# EAGLE design STM (EAGLE 6.3)
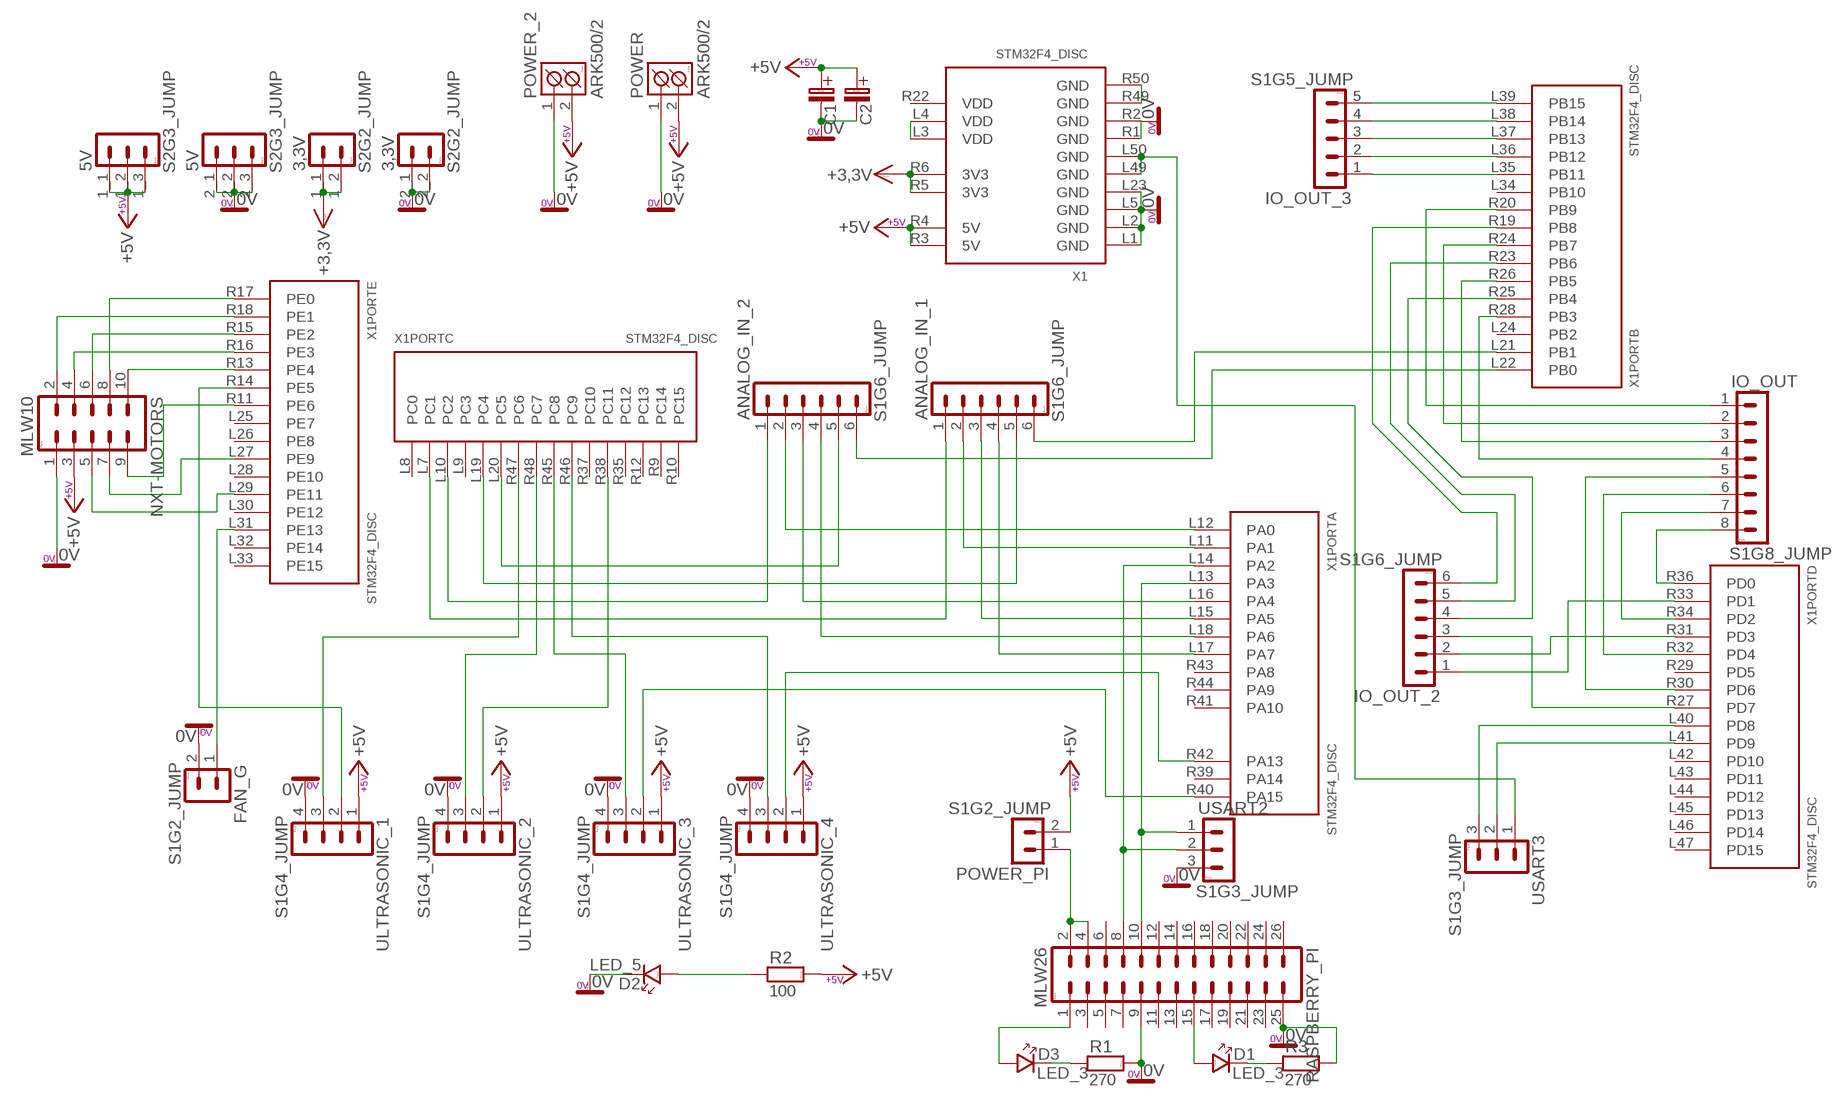
[diagram p0: schematic, sheet 1]

## Parts
3,3V  S2G2_JUMP  [S2G2_JUM]
5V  S2G3_JUMP  [S2G3_JUM]
ANALOG_IN_1  S1G6_JUMP  [S1G6_JUM]
ANALOG_IN_2  S1G6_JUMP  [S1G6_JUM]
C1  #_RADIAL_POUZDRA5  [C_EL_5]
C2  #_RADIAL_POUZDRA5  [C_EL_5]
D1  LED_3  [LED_3]
D2  LED_5  [LED_5]
D3  LED_3  [LED_3]
FAN_G  S1G2_JUMP  [S1G2_JUM]
IO_OUT  S1G8_JUMP  [S1G8_JUM]
IO_OUT_2  S1G6_JUMP  [S1G6_JUM]
IO_OUT_3  S1G5_JUMP  [S1G5_JUM]
NXT-MOTORS  MLW10  [MLW10G]
POWER  ARK500/2  [ARK500/2]
POWER_2  ARK500/2  [ARK500/2]
POWER_PI  S1G2_JUMP  [S1G2_JUM]
R1  270  4K7  [R_7,5]
R2  100  100R  [R_7,5]
R3  270  4K7  [R_7,5]
RASPBERRY_PI  MLW26  [MLW26G]
ULTRASONIC_1  S1G4_JUMP  [S1G4_JUM]
ULTRASONIC_2  S1G4_JUMP  [S1G4_JUM]
ULTRASONIC_3  S1G4_JUMP  [S1G4_JUM]
ULTRASONIC_4  S1G4_JUMP  [S1G4_JUM]
USART2  S1G3_JUMP  [S1G3_JUM]
USART3  S1G3_JUMP  [S1G3_JUM]
X1  STM32F4_DISC  [STM32F4_DISC]

## Nets
0V: 3,3V.2_1 3,3V.2_2 5V.2_1 5V.2_2 5V.2_3 C1.C-(C_EL-) C2.C-(C_EL-) D2.K FAN_G.2 NXT-MOTORS.1 POWER.1(K1) POWER_2.1(K1) R1.2 R3.2 RASPBERRY_PI.9 RASPBERRY_PI.25 ULTRASONIC_1.4 ULTRASONIC_2.4 ULTRASONIC_3.4 ULTRASONIC_4.4 USART2.3 X1.L1(GND) X1.L2(GND) X1.L5(GND) X1.L23(GND) X1.R1(GND) X1.R2(GND)
+5V: 5V.1_1 5V.1_2 5V.1_3 C1.C+(C_EL+) C2.C+(C_EL+) NXT-MOTORS.3 POWER.2(K2) POWER_2.2(K2) POWER_PI.2 R2.2 ULTRASONIC_1.1 ULTRASONIC_2.1 ULTRASONIC_3.1 ULTRASONIC_4.1 X1.R3(5V) X1.R4(5V)
N$1: ANALOG_IN_1.6 X1.L21(PB1)
N$2: NXT-MOTORS.8 X1.R17(PE0)
N$3: RASPBERRY_PI.8 USART2.2 X1.L14(PA2)
N$4: RASPBERRY_PI.10 USART2.1 X1.L13(PA3)
N$5: USART3.2 X1.L41(PD9)
N$6: USART3.3 X1.L40(PD8)
N$7: NXT-MOTORS.2 X1.R18(PE1)
N$8: NXT-MOTORS.6 X1.R15(PE2)
N$9: NXT-MOTORS.10 X1.R13(PE4)
N$10: NXT-MOTORS.4 X1.R16(PE3)
N$11: NXT-MOTORS.5 X1.L29(PE11)
N$12: ULTRASONIC_1.2 X1.R14(PE5)
N$13: NXT-MOTORS.7 X1.L27(PE9)
N$14: NXT-MOTORS.9 X1.R11(PE6)
N$15: ULTRASONIC_1.3 X1.R47(PC6)
N$16: ULTRASONIC_4.3 X1.R46(PC9)
N$17: ULTRASONIC_2.3 X1.R48(PC7)
N$18: ULTRASONIC_3.3 X1.R45(PC8)
N$19: ANALOG_IN_2.3 X1.L16(PA4)
N$20: ANALOG_IN_1.2 X1.L11(PA1)
N$21: ANALOG_IN_2.2 X1.L12(PA0)
N$22: ANALOG_IN_1.3 X1.L15(PA5)
N$23: ANALOG_IN_1.4 X1.L17(PA7)
N$24: ANALOG_IN_2.4 X1.L18(PA6)
N$25: ANALOG_IN_2.6 X1.L22(PB0)
N$26: X1.L3(VDD) X1.L4(VDD)
N$27: FAN_G.1 X1.L31(PE13)
N$28: D1.K R3.1
N$29: D1.A RASPBERRY_PI.15
N$30: D2.A R2.1
N$31: IO_OUT.4 X1.R28(PB3)
N$32: IO_OUT.3 X1.R26(PB5)
N$33: IO_OUT.2 X1.R24(PB7)
N$34: IO_OUT_2.3 X1.R27(PD7)
N$35: IO_OUT.5 X1.R30(PD6)
N$36: IO_OUT.6 X1.R32(PD4)
N$37: IO_OUT_2.2 X1.R31(PD3)
N$38: IO_OUT.7 X1.R34(PD2)
N$39: IO_OUT_2.1 X1.R33(PD1)
N$40: IO_OUT.8 X1.R36(PD0)
N$41: IO_OUT.1 X1.R20(PB9)
N$42: IO_OUT_2.5 X1.R23(PB6)
N$43: IO_OUT_3.2 X1.L36(PB12)
N$44: D3.K R1.1
N$45: IO_OUT_3.4 X1.L38(PB14)
N$46: IO_OUT_2.6 X1.R19(PB8)
N$47: IO_OUT_2.4 X1.R25(PB4)
N$48: IO_OUT_3.1 X1.L35(PB11)
N$49: D3.A RASPBERRY_PI.1
N$50: IO_OUT_3.3 X1.L37(PB13)
N$51: POWER_PI.1 RASPBERRY_PI.2 RASPBERRY_PI.4
N$52: IO_OUT_3.5 X1.L39(PB15)
N$53: USART3.1 X1.L49(GND) X1.L50(GND)
N$54: ANALOG_IN_2.5 X1.L20(PC5)
N$55: ANALOG_IN_1.5 X1.L19(PC4)
N$56: ANALOG_IN_2.1 X1.L10(PC2)
N$57: ANALOG_IN_1.1 X1.L7(PC1)
N$58: ULTRASONIC_2.2 X1.R38(PC11)
N$59: ULTRASONIC_3.2 X1.R40(PA15)
N$60: ULTRASONIC_4.2 X1.R42(PA13)
N$61: X1.R49(GND) X1.R50(GND)
VCC: 3,3V.1_1 3,3V.1_2 X1.R5(3V3) X1.R6(3V3) ; supply symbol labelled +3,3V
Unconnected: RASPBERRY_PI.3 RASPBERRY_PI.5 RASPBERRY_PI.6 RASPBERRY_PI.7 RASPBERRY_PI.11 RASPBERRY_PI.12 RASPBERRY_PI.13 RASPBERRY_PI.14 RASPBERRY_PI.16 RASPBERRY_PI.17 RASPBERRY_PI.18 RASPBERRY_PI.19 RASPBERRY_PI.20 RASPBERRY_PI.21 RASPBERRY_PI.22 RASPBERRY_PI.23 RASPBERRY_PI.24 RASPBERRY_PI.26 X1.L6(!RST) X1.L8(PC0) X1.L9(PC3) X1.L24(PB2) X1.L25(PE7) X1.L26(PE8) X1.L28(PE10) X1.L30(PE12) X1.L32(PE14) X1.L33(PE15) X1.L34(PB10) X1.L42(PD10) X1.L43(PD11) X1.L44(PD12) X1.L45(PD13) X1.L46(PD14) X1.L47(PD15) X1.L48(NC) X1.R7(PH0) X1.R8(PH1) X1.R9(PC14) X1.R10(PC15) X1.R12(PC13) X1.R21(BOOT0) X1.R29(PD5) X1.R35(PC12) X1.R37(PC10) X1.R39(PA14) X1.R41(PA10) X1.R43(PA8) X1.R44(PA9) X1.T1(JP2A) X1.T2(JP2B) X1.T3(JP3A) X1.T4(JP3B)

## Power pins joined to a net without a drawn wire
VDD: X1.R22(VDD)

## Library data of the parts
3,3V = #PaJa_konektory:S2G2_JUMP: Radove konektory - koliky - dvojite - 2x2
5V = #PaJa_konektory:S2G3_JUMP: Radove konektory - koliky - dvojite - 2x3
ANALOG_IN_1 ANALOG_IN_2 IO_OUT_2 = #PaJa_konektory:S1G6_JUMP: Radove konektory - koliky - 6x
C1 C2 = #PaJa_C-el_2:#_RADIAL_POUZDRA
D1-D3 = #PaJa_30:LED: LED - jednobarevna
FAN_G POWER_PI = #PaJa_konektory:S1G2_JUMP: Radove konektory - koliky - 2x
IO_OUT = #PaJa_konektory:S1G8_JUMP: Radove konektory - koliky - 8x
IO_OUT_3 = #PaJa_konektory:S1G5_JUMP: Radove konektory - koliky - 5x
NXT-MOTORS = #PaJa_konektory:MLW10: Konektory MLW - vidlice - 10x
POWER POWER_2 = #PaJa_konektory:ARK500/2: Svorkovnice - roztec 5mm - dvojita
R1 R3 = #PaJa_R:4K7
R2 = #PaJa_R:100R
RASPBERRY_PI = #PaJa_konektory:MLW26: Konektory MLW - vidlice - 26x
ULTRASONIC_1-ULTRASONIC_4 = #PaJa_konektory:S1G4_JUMP: Radove konektory - koliky - 4x
USART2 USART3 = #PaJa_konektory:S1G3_JUMP: Radove konektory - koliky - 3x
X1 = stm32f4_disc:STM32F4_DISC: STM32F4 Discovery Board

## Board
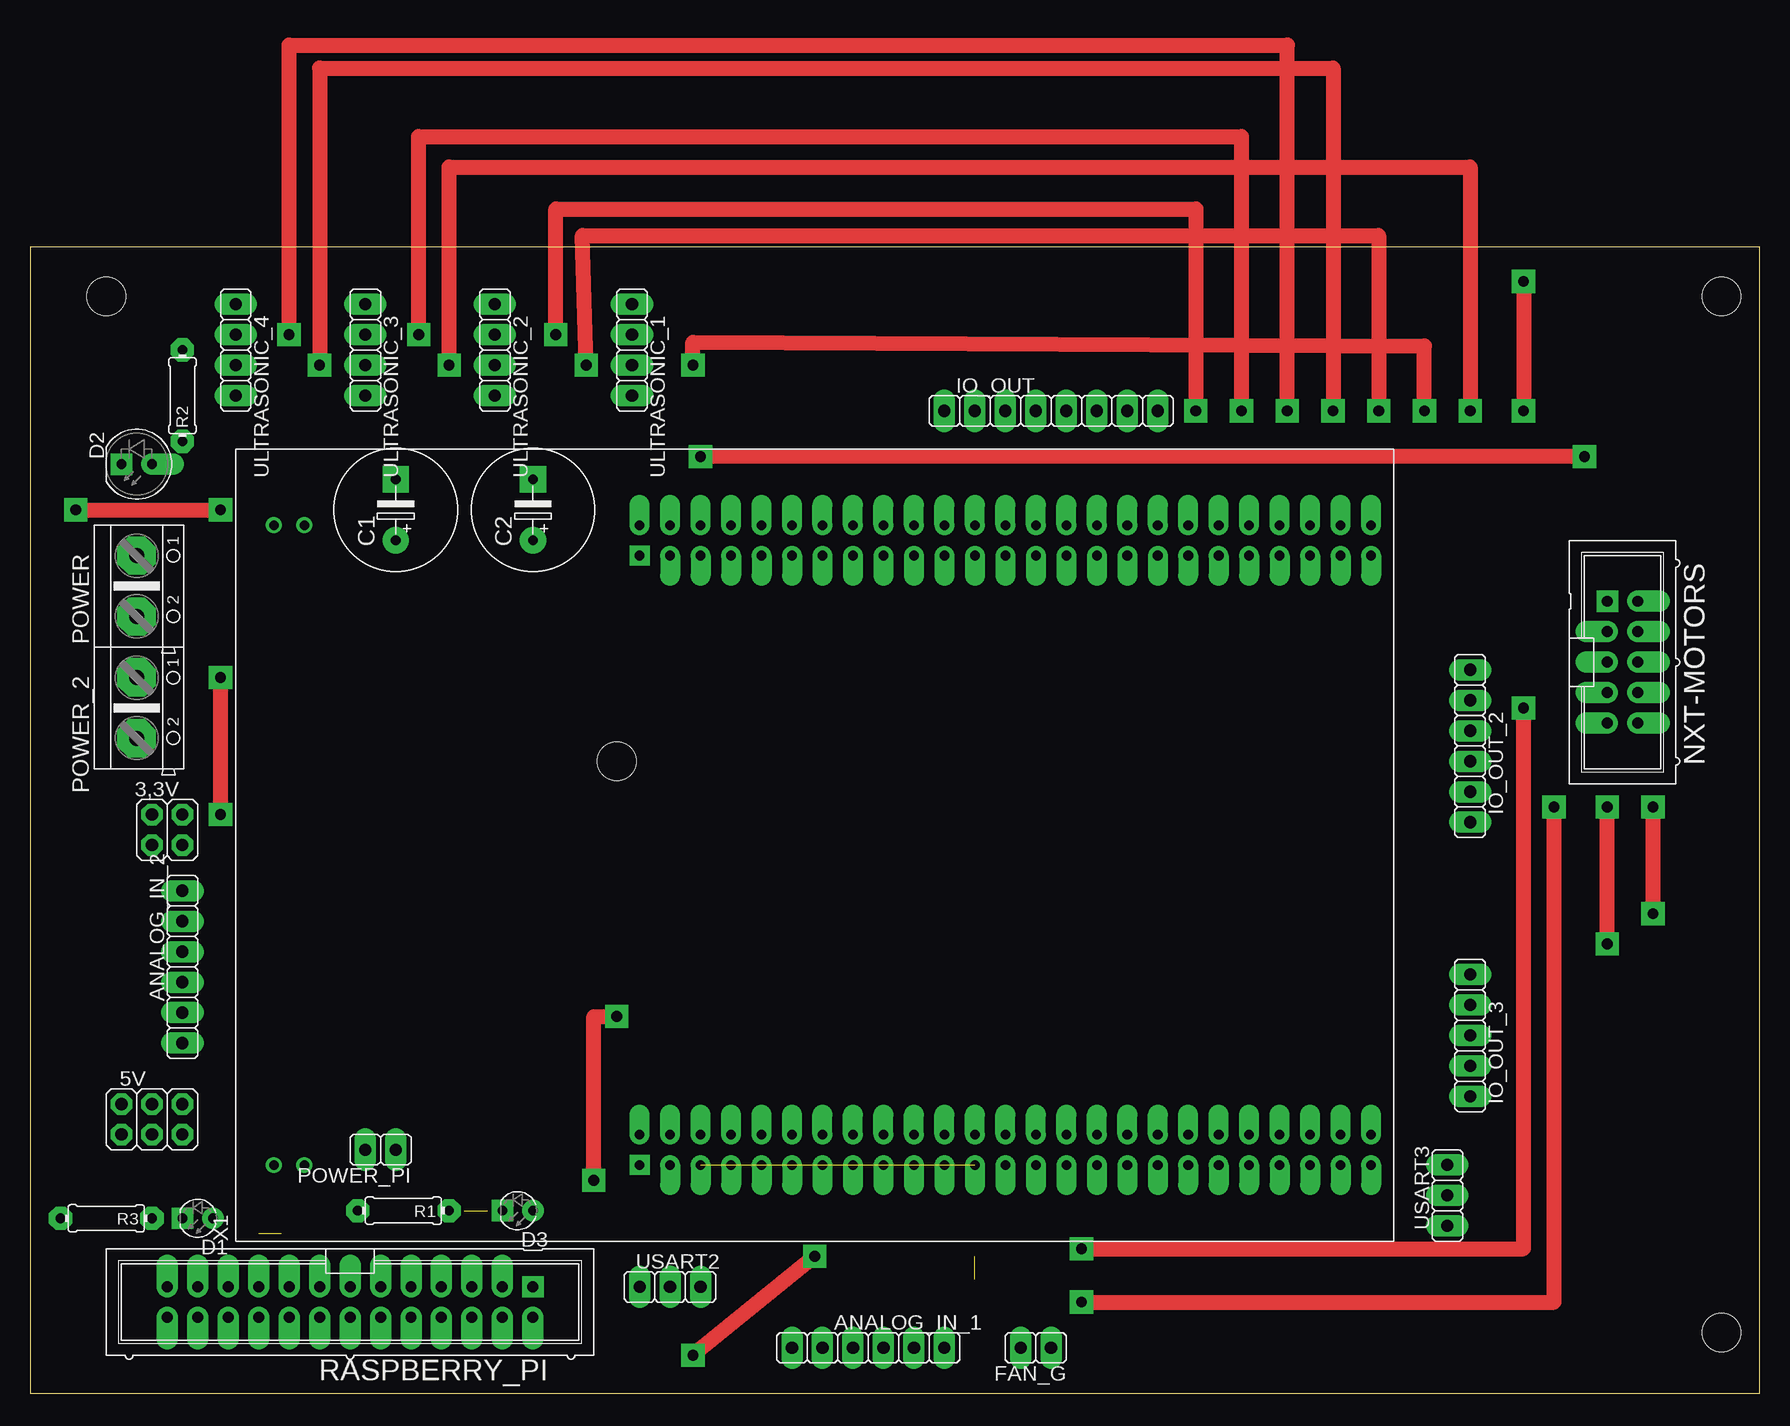
[diagram p1: board, top side]
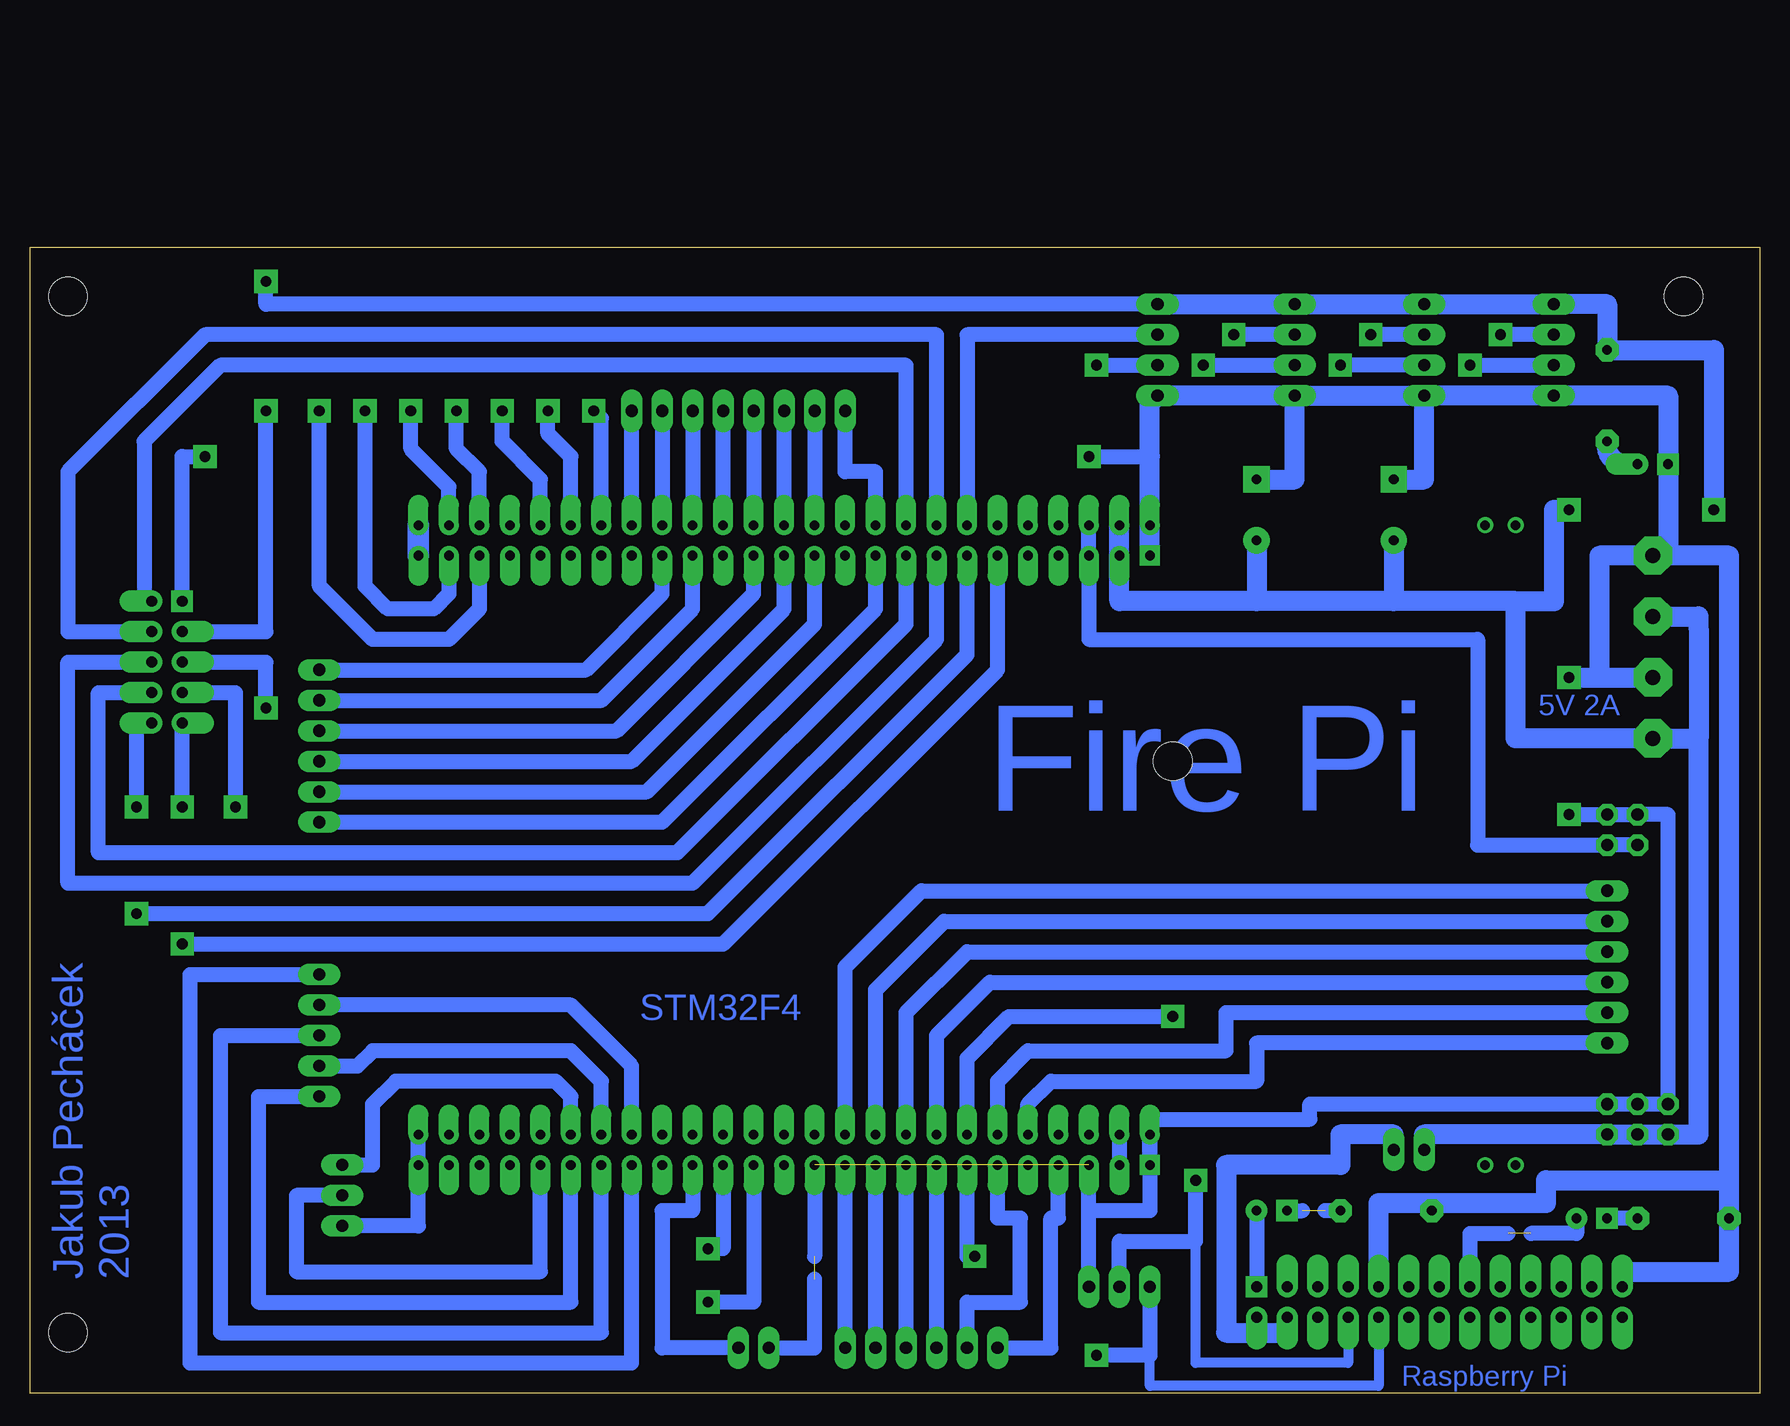
[diagram p2: board, bottom side, seen from below]

Size 144.12 x 95.56 mm. Coordinates in mm from the lower left corner, seen from the top.
Outline: 0,0 144.12,0 144.12,95.56 0,95.56 0,0
Copper layers (1*16): Top 0.035mm / dielectric 1.5mm / Bottom 0.035mm
Design rules "default *": minimum track width 50mil, minimum drill 0.8mm, track to track 8mil, track to pad 8mil, pad to pad 8mil, via to via 8mil, smd to smd 8mil, copper to edge 40mil, drill to drill 8mil, minimum pad ring 10mil, minimum via ring 8mil, stop-mask expansion 4mil, vias tented up to drill 0mil, thermal gap 10mil
Holes 3.2 mm at 140.97,5.08 140.97,91.44 48.9,52.7 6.35,91.44

### Footprints (pad centres in the part's own frame; a part is rotated, then mirrored left to right if it is on the bottom)
S2G2_JUM = drill 1.016 pad 1.778 octagon: 1_1 -1.27,-1.27; 1_2 1.27,-1.27; 2_1 -1.27,1.27; 2_2 1.27,1.27
S2G3_JUM = drill 1.016 pad 1.778 octagon: 1_1 -2.54,-1.27; 1_2 0,-1.27; 1_3 2.54,-1.27; 2_1 -2.54,1.27; 2_2 0,1.27; 2_3 2.54,1.27
S1G6_JUM = drill 1.016 pad 1.778 long: 1 -6.35,0; 2 -3.81,0; 3 -1.27,0; 4 1.27,0; 5 3.81,0; 6 6.35,0
C_EL_5 = drill 0.813 pad 2.184: C+ -2.54,0 | drill 0.813 pad 2.184 square: C- 2.54,0
LED_3 = drill 0.813 pad 1.778: A -1.27,0 | drill 0.813 pad 1.778 square: K 1.27,0
LED_5 = drill 0.813 pad 1.778 offset: A -1.27,0 | drill 0.813 pad 1.778 square: K 1.27,0
S1G2_JUM = drill 1.016 pad 1.778 long: 1 -1.27,0; 2 1.27,0
S1G8_JUM = drill 1.016 pad 1.778 long: 1 -8.89,0; 2 -6.35,0; 3 -3.81,0; 4 -1.27,0; 5 1.27,0; 6 3.81,0; 7 6.35,0; 8 8.89,0
S1G5_JUM = drill 1.016 pad 1.778 long: 1 -5.08,0; 2 -2.54,0; 3 0,0; 4 2.54,0; 5 5.08,0
MLW10G = drill 0.914 pad 1.778 square: 1 -5.08,-1.27 | drill 0.914 pad 1.778 offset: 2 -5.08,1.27; 3 -2.54,-1.27; 4 -2.54,1.27; 5 0,-1.27; 6 0,1.27; 7 2.54,-1.27; 8 2.54,1.27; 9 5.08,-1.27; 10 5.08,1.27
ARK500/2 = drill 1.27 pad 3.2 octagon: 1 -2.54,0; 2 2.54,0
R_7,5 = drill 0.813 pad 1.93 octagon: 1 -3.81,0; 2 3.81,0
MLW26G = drill 0.914 pad 1.778 square: 1 -15.24,-1.27 | drill 0.914 pad 1.778 offset: 2 -15.24,1.27; 3 -12.7,-1.27; 4 -12.7,1.27; 5 -10.16,-1.27; 6 -10.16,1.27; 7 -7.62,-1.27; 8 -7.62,1.27; 9 -5.08,-1.27; 10 -5.08,1.27; 11 -2.54,-1.27; 12 -2.54,1.27; 13 0,-1.27; 14 0,1.27; 15 2.54,-1.27; 16 2.54,1.27; 17 5.08,-1.27; 18 5.08,1.27; 19 7.62,-1.27; 20 7.62,1.27; 21 10.16,-1.27; 22 10.16,1.27; 23 12.7,-1.27; 24 12.7,1.27; 25 15.24,-1.27; 26 15.24,1.27
S1G4_JUM = drill 1.016 pad 1.778 long: 1 -3.81,0; 2 -1.27,0; 3 1.27,0; 4 3.81,0
S1G3_JUM = drill 1.016 pad 1.778 long: 1 -2.54,0; 2 0,0; 3 2.54,0
STM32F4_DISC = drill 0.8 pad 1.676 square: L1 -27.94,30.48; R1 22.86,30.48 | drill 0.8 pad 1.676 offset: L2 -25.4,30.48; L3 -27.94,27.94; L4 -25.4,27.94; L5 -27.94,25.4; L6 -25.4,25.4; L7 -27.94,22.86; L8 -25.4,22.86; L9 -27.94,20.32; L10 -25.4,20.32; L11 -27.94,17.78; L12 -25.4,17.78; L13 -27.94,15.24; L14 -25.4,15.24; L15 -27.94,12.7; L16 -25.4,12.7; L17 -27.94,10.16; L18 -25.4,10.16; L19 -27.94,7.62; L20 -25.4,7.62; L21 -27.94,5.08; L22 -25.4,5.08; L23 -27.94,2.54; L24 -25.4,2.54; L25 -27.94,0; L26 -25.4,0; L27 -27.94,-2.54; L28 -25.4,-2.54; L29 -27.94,-5.08; L30 -25.4,-5.08; L31 -27.94,-7.62; L32 -25.4,-7.62; L33 -27.94,-10.16; L34 -25.4,-10.16; L35 -27.94,-12.7; L36 -25.4,-12.7; L37 -27.94,-15.24; L38 -25.4,-15.24; L39 -27.94,-17.78; L40 -25.4,-17.78; L41 -27.94,-20.32; L42 -25.4,-20.32; L43 -27.94,-22.86; L44 -25.4,-22.86; L45 -27.94,-25.4; L46 -25.4,-25.4; L47 -27.94,-27.94; L48 -25.4,-27.94; L49 -27.94,-30.48; L50 -25.4,-30.48; R2 25.4,30.48; R3 22.86,27.94; R4 25.4,27.94; R5 22.86,25.4; R6 25.4,25.4; R7 22.86,22.86; R8 25.4,22.86; R9 22.86,20.32; R10 25.4,20.32; R11 22.86,17.78; R12 25.4,17.78; R13 22.86,15.24; R14 25.4,15.24; R15 22.86,12.7; R16 25.4,12.7; R17 22.86,10.16; R18 25.4,10.16; R19 22.86,7.62; R20 25.4,7.62; R21 22.86,5.08; R22 25.4,5.08; R23 22.86,2.54; R24 25.4,2.54; R25 22.86,0; R26 25.4,0; R27 22.86,-2.54; R28 25.4,-2.54; R29 22.86,-5.08; R30 25.4,-5.08; R31 22.86,-7.62; R32 25.4,-7.62; R33 22.86,-10.16; R34 25.4,-10.16; R35 22.86,-12.7; R36 25.4,-12.7; R37 22.86,-15.24; R38 25.4,-15.24; R39 22.86,-17.78; R40 25.4,-17.78; R41 22.86,-20.32; R42 25.4,-20.32; R43 22.86,-22.86; R44 25.4,-22.86; R45 22.86,-25.4; R46 25.4,-25.4; R47 22.86,-27.94; R48 25.4,-27.94; R49 22.86,-30.48; R50 25.4,-30.48 | drill 0.8: T1 -27.94,60.96; T2 -27.94,58.42; T3 25.4,60.96; T4 25.4,58.42

### Placement (x,y rotation side)
3,3V  11.43,46.99 0 top
5V  10.16,22.86 0 top
ANALOG_IN_1  69.85,3.81 0 top
ANALOG_IN_2  12.7,35.56 90 top
C1  30.48,73.66 90 top
C2  41.91,73.66 90 top
D1  13.97,14.61 180 top
D2  8.89,77.47 180 top
D3  40.64,15.24 180 top
FAN_G  83.82,3.81 180 top
IO_OUT  85.09,81.92 0 top
IO_OUT_2  120.02,53.98 270 top
IO_OUT_3  120.02,29.84 270 top
NXT-MOTORS  132.72,60.96 270 top
POWER  8.89,67.31 270 top
POWER_2  8.89,57.15 270 top
POWER_PI  29.21,20.32 180 top
R1  31.11,15.24 180 top
R2  12.7,83.19 90 top
R3  6.35,14.61 180 top
RASPBERRY_PI  26.67,7.62 180 top
ULTRASONIC_1  50.16,87 270 top
ULTRASONIC_2  38.73,87 270 top
ULTRASONIC_3  27.94,87 270 top
ULTRASONIC_4  17.14,87 270 top
USART2  53.34,8.89 0 top
USART3  118.11,16.51 90 top
X1  81.28,46.99 90 top

### Tracks (layer width: path | path; a pad name or v marks a point on that pad's centre or on a via)
0V  (via drill 0.9 pad 1.93)  (2 unrouted)
  Top 1.27: v129.54,78.11 v55.88,78.11 | v15.88,48.26 v15.88,59.69
  Bottom 1.27: FAN_G.2 78.74,3.81 78.74,9.53 | 55.88,15.24 X1.L5 | 55.88,15.24 50.8,15.24 X1.L1 | X1.L2 X1.L1 | USART2.3 55.88,15.24 | v55.88,78.11 50.8,78.11 | X1.L23 78.74,11.43 | NXT-MOTORS.1 131.44,78.11 v129.54,78.11 | v15.88,48.26 3,3V.2_2 3,3V.2_1 7.62,48.26 5V.2_1 | 5V.2_3 5V.2_2 5V.2_1 | 5V.2_3 5V.2_1 | X1.L1 50.8,22.86 37.47,22.86 37.47,24.13 5V.2_3
  Bottom 1.676: 13.34,59.69 13.34,69.85 POWER.1 7.62,69.85 | RASPBERRY_PI.9 31.75,15.88 27.3,15.88 | 2.54,17.78 R3.2 2.54,10.16 11.43,10.16 RASPBERRY_PI.25 | 2.54,17.78 2.54,69.85 7.62,69.85 | 13.34,59.69 POWER_2.1 | 27.3,15.88 17.78,15.88 17.78,17.78 2.54,17.78 | X1.R1 X1.R2 50.8,78.11 50.8,82.55 ULTRASONIC_1.4 ULTRASONIC_2.4 | ULTRASONIC_3.4 ULTRASONIC_4.4 7.62,83.19 D2.K 7.62,69.85 | ULTRASONIC_2.4 ULTRASONIC_3.4 | R1.2 27.3,15.88 | C1.C- 27.94,76.2 ULTRASONIC_3.4 | C2.C- 38.73,76.2 ULTRASONIC_2.4 | v15.88,59.69 13.34,59.69
+5V  (via drill 0.9 pad 1.93)
  Top 1.27: v3.81,73.66 v15.88,73.66 | v124.46,92.71 v124.46,81.92
  Bottom 1.27: 5.08,63.77 arc-90 6.08,64.77 POWER.2 | NXT-MOTORS.3 124.46,63.5 v124.46,81.92 | ULTRASONIC_4.1 ULTRASONIC_3.1 ULTRASONIC_2.1 ULTRASONIC_1.1 124.46,90.81 v124.46,92.71
  Bottom 1.676: 5.08,54.61 5.08,21.59 5V.1_1 5V.1_2 5V.1_3 27.94,21.59 POWER_PI.2 | 5.08,54.61 POWER_2.2 20.32,54.61 20.32,66.04 | POWER.2 5.08,64.77 5.08,63.77 5.08,54.61 | 20.32,66.04 30.48,66.04 | 30.48,66.04 41.91,66.04 | 41.91,66.04 53.34,66.04 X1.R3 X1.R4 | ULTRASONIC_1.1 ULTRASONIC_4.1 12.7,90.81 R2.2 3.81,87 v3.81,73.66 | v15.88,73.66 17.14,73.66 17.14,66.04 20.32,66.04 | C1.C+ 30.48,66.04 | C2.C+ 41.91,66.04
N$1
  Bottom 1.27: ANALOG_IN_1.6 X1.L21
N$2
  Bottom 1.27: NXT-MOTORS.8 138.43,58.42 138.43,45.09 90.17,45.09 71.12,64.14 X1.R17
N$3  (via drill 0.9 pad 1.93)
  Top 1.27: v46.99,17.78 46.99,31.43 v48.9,31.43
  Bottom 0.813: RASPBERRY_PI.8 34.29,2.54 46.99,2.54 46.99,12.7
  Bottom 1.27: v46.99,17.78 46.99,12.7 53.34,12.7 USART2.2 | X1.L14 66.04,27.94 62.55,31.43 v48.9,31.43
N$4  (via drill 0.9 pad 1.93)
  Top 1.27: v65.41,11.43 v55.24,3.17
  Bottom 0.813: RASPBERRY_PI.10 31.75,0.64 50.8,0.64 50.8,3.17
  Bottom 1.27: v55.24,3.17 50.8,3.17 USART2.1 | v65.41,11.43 66.04,11.43 X1.L13
N$5
  Bottom 1.27: USART3.2 121.92,16.51 121.92,10.16 101.6,10.16 X1.L41
N$6
  Bottom 1.27: USART3.3 115.57,19.05 115.57,24.13 113.67,26.04 100.33,26.04 99.06,24.77 X1.L40
N$7
  Bottom 1.27: X1.R18 71.12,85.72 128.27,85.72 134.62,79.38 134.62,66.04 NXT-MOTORS.2
N$8
  Bottom 1.27: NXT-MOTORS.6 140.97,60.96 140.97,42.55 88.9,42.55 68.58,62.87 X1.R15
N$9  (via drill 0.9 pad 1.93)
  Top 1.27: v135.25,40.01 v135.25,48.9
  Bottom 1.27: NXT-MOTORS.10 135.25,55.88 v135.25,48.9 | v135.25,40.01 87.63,40.01 66.04,61.59 X1.R13
N$10
  Bottom 1.27: X1.R16 68.58,88.27 129.54,88.27 140.97,76.83 140.97,63.5 NXT-MOTORS.4
N$11  (via drill 0.9 pad 1.93)
  Top 1.27: v87.63,12.06 124.46,12.06 v124.46,57.15
  Bottom 1.27: NXT-MOTORS.5 124.46,60.96 v124.46,57.15 | X1.L29 86.36,12.06 v87.63,12.06
N$12
  Bottom 1.27: ULTRASONIC_1.2 66.04,88.27 X1.R14
N$13  (via drill 0.9 pad 1.93)
  Top 1.27: v87.63,7.62 127,7.62 v127,48.9
  Bottom 1.27: NXT-MOTORS.7 127,58.42 v127,48.9 | X1.L27 83.82,7.62 v87.63,7.62
N$14  (via drill 0.9 pad 1.93)
  Top 1.27: v131.44,37.47 v131.44,48.9
  Bottom 1.27: v131.44,48.9 NXT-MOTORS.9 | v131.44,37.47 86.36,37.47 63.5,60.33 X1.R11
N$15  (via drill 0.9 pad 1.93)
  Top 1.27: v55.24,85.72 55.24,87.63 116.2,87.31 v116.2,81.92
  Bottom 1.27: v55.24,85.72 ULTRASONIC_1.3 | v116.2,81.92 116.2,67.31 114.3,65.41 110.49,65.41 109.22,66.67 X1.R47
N$16  (via drill 0.9 pad 1.93)
  Top 1.27: v108.58,81.92 108.58,110.49 24.13,110.49 v24.13,85.72
  Bottom 1.27: v24.13,85.72 ULTRASONIC_4.3 | X1.R46 106.68,76.83 108.58,78.74 v108.58,81.92
N$17  (via drill 0.9 pad 1.93)
  Top 1.27: v46.35,85.72 46.04,96.52 112.39,96.52 v112.39,81.92
  Bottom 1.27: v46.35,85.72 ULTRASONIC_2.3 | X1.R48 109.22,75.56 112.39,78.74 v112.39,81.92
N$18  (via drill 0.9 pad 1.93)
  Top 1.27: v34.92,85.72 34.92,102.23 120.02,102.23 v120.02,81.92
  Bottom 1.27: ULTRASONIC_3.3 v34.92,85.72 | v120.02,81.92 120.02,67.31 115.57,62.87 109.22,62.87 106.68,65.41 X1.R45
N$19
  Bottom 1.27: X1.L16 68.58,29.84 64.14,34.29 ANALOG_IN_2.3
N$20
  Bottom 1.27: ANALOG_IN_1.2 66.04,7.62 61.59,7.62 61.59,14.61 63.5,14.61 X1.L11
N$21
  Bottom 1.27: ANALOG_IN_2.2 44.45,31.75 44.45,28.57 60.96,28.57 63.5,26.04 X1.L12
N$22
  Bottom 1.27: ANALOG_IN_1.3 X1.L15
N$23
  Bottom 1.27: ANALOG_IN_1.4 X1.L17
N$24
  Bottom 1.27: X1.L18 71.12,31.75 66.04,36.83 ANALOG_IN_2.4
N$25
  Bottom 1.27: X1.L22 76.2,35.56 69.85,41.91 ANALOG_IN_2.6
N$26
  Bottom 1.27: X1.L4 X1.L3
N$27
  Bottom 1.27: FAN_G.1 91.44,3.81 91.44,15.24 88.9,15.24 X1.L31
N$28
  Bottom 1.27: R3.1 D1.K
N$29  (1 unrouted)
  Bottom 1.27: RASPBERRY_PI.15 24.13,13.34 20.95,13.34 | D1.A 15.24,13.34 19.05,13.34
N$30
  Bottom 1.676: D2.A 11.43,77.47 arc90 R2.1
N$31
  Bottom 1.27: IO_OUT.4 X1.R28
N$32
  Bottom 1.27: X1.R26 IO_OUT.3
N$33
  Bottom 1.27: IO_OUT.2 X1.R24
N$34
  Bottom 1.27: IO_OUT_2.3 95.25,55.24 83.82,66.67 X1.R27
N$35
  Bottom 1.27: X1.R30 IO_OUT.5
N$36
  Bottom 1.27: IO_OUT.6 X1.R32
N$37
  Bottom 1.27: IO_OUT_2.2 96.52,57.78 88.9,65.41 X1.R31
N$38
  Bottom 1.27: IO_OUT.7 X1.R34
N$39
  Bottom 1.27: IO_OUT_2.1 97.79,60.33 91.44,66.67 X1.R33
N$40
  Bottom 1.27: X1.R36 IO_OUT.8
N$41
  Bottom 1.27: X1.R20 73.66,76.83 76.2,76.83 IO_OUT.1
N$42
  Bottom 1.27: IO_OUT_2.5 92.71,50.16 78.74,64.14 X1.R23
N$43
  Bottom 1.27: X1.L36 93.98,27.3 99.06,32.38 IO_OUT_3.2
N$44  (1 unrouted)
  Bottom 1.27: R1.1 36.2,15.24 | D3.K 38.1,15.24
N$45
  Bottom 1.27: IO_OUT_3.4 116.84,27.3 115.57,28.57 99.06,28.57 96.52,26.04 X1.L38
N$46
  Bottom 1.27: IO_OUT_2.6 91.44,47.62 73.66,65.41 X1.R19
N$47
  Bottom 1.27: IO_OUT_2.4 93.98,52.7 81.28,65.41 X1.R25
N$48
  Bottom 1.27: X1.L35 93.98,2.54 130.81,2.54 130.81,34.92 IO_OUT_3.1
N$49
  Bottom 1.27: D3.A RASPBERRY_PI.1
N$50
  Bottom 1.27: X1.L37 96.52,5.08 128.27,5.08 128.27,29.84 IO_OUT_3.3
N$51
  Bottom 1.676: POWER_PI.1 30.48,21.59 34.92,21.59 34.92,19.05 44.45,19.05 44.45,5.08 41.91,5.08 | 41.91,5.08 39.37,5.08 RASPBERRY_PI.4 | RASPBERRY_PI.2 41.91,5.08
N$52
  Bottom 1.27: X1.L39 99.06,7.62 125.09,7.62 125.09,24.77 IO_OUT_3.5
N$53
  Bottom 1.27: X1.L50 X1.L49 111.76,13.97 USART3.1
N$54
  Bottom 1.27: X1.L20 73.66,33.66 67.94,39.37 ANALOG_IN_2.5
N$55
  Bottom 1.27: ANALOG_IN_1.5 X1.L19
N$56
  Bottom 1.27: ANALOG_IN_2.1 41.91,29.21 41.91,26.04 59.05,26.04 60.96,24.13 X1.L10
N$57
  Bottom 1.27: ANALOG_IN_1.1 59.05,3.81 59.05,14.61 58.42,14.61 X1.L7
N$58  (via drill 0.9 pad 1.93)
  Top 1.27: v43.81,88.27 43.81,98.74 97.16,98.74 v97.16,81.92
  Bottom 1.27: ULTRASONIC_2.2 v43.81,88.27 | X1.R38 96.52,81.28 v97.16,81.92
N$59  (via drill 0.9 pad 1.93)
  Top 1.27: v32.38,88.27 32.38,104.78 100.97,104.78 v100.97,81.92
  Bottom 1.27: ULTRASONIC_3.2 v32.38,88.27 | X1.R40 99.06,78.11 100.97,80.01 v100.97,81.92
N$60  (via drill 0.9 pad 1.93)
  Top 1.27: v21.59,88.27 21.59,112.39 104.78,112.39 v104.78,81.92
  Bottom 1.27: ULTRASONIC_4.2 v21.59,88.27 | X1.R42 101.6,76.2 104.78,79.38 v104.78,81.92
N$61
  Bottom 1.778: X1.R50 X1.R49
VCC
  Bottom 1.27: X1.R6 X1.R5 55.88,62.87 23.5,62.87 23.5,45.72 3,3V.1_2 3,3V.1_1

### Text on the board
Bottom: 5V 2A | Fire Pi | STM32F4 | Jakub Pecháček / 2013 | Raspberry Pi